# EAGLE schematic Power (EAGLE 8.5.2)
DESIGNER: Bradley L. Davis; PROJECT: CougSat-1; REV: 2.0.2

## Sheet 1 of 3
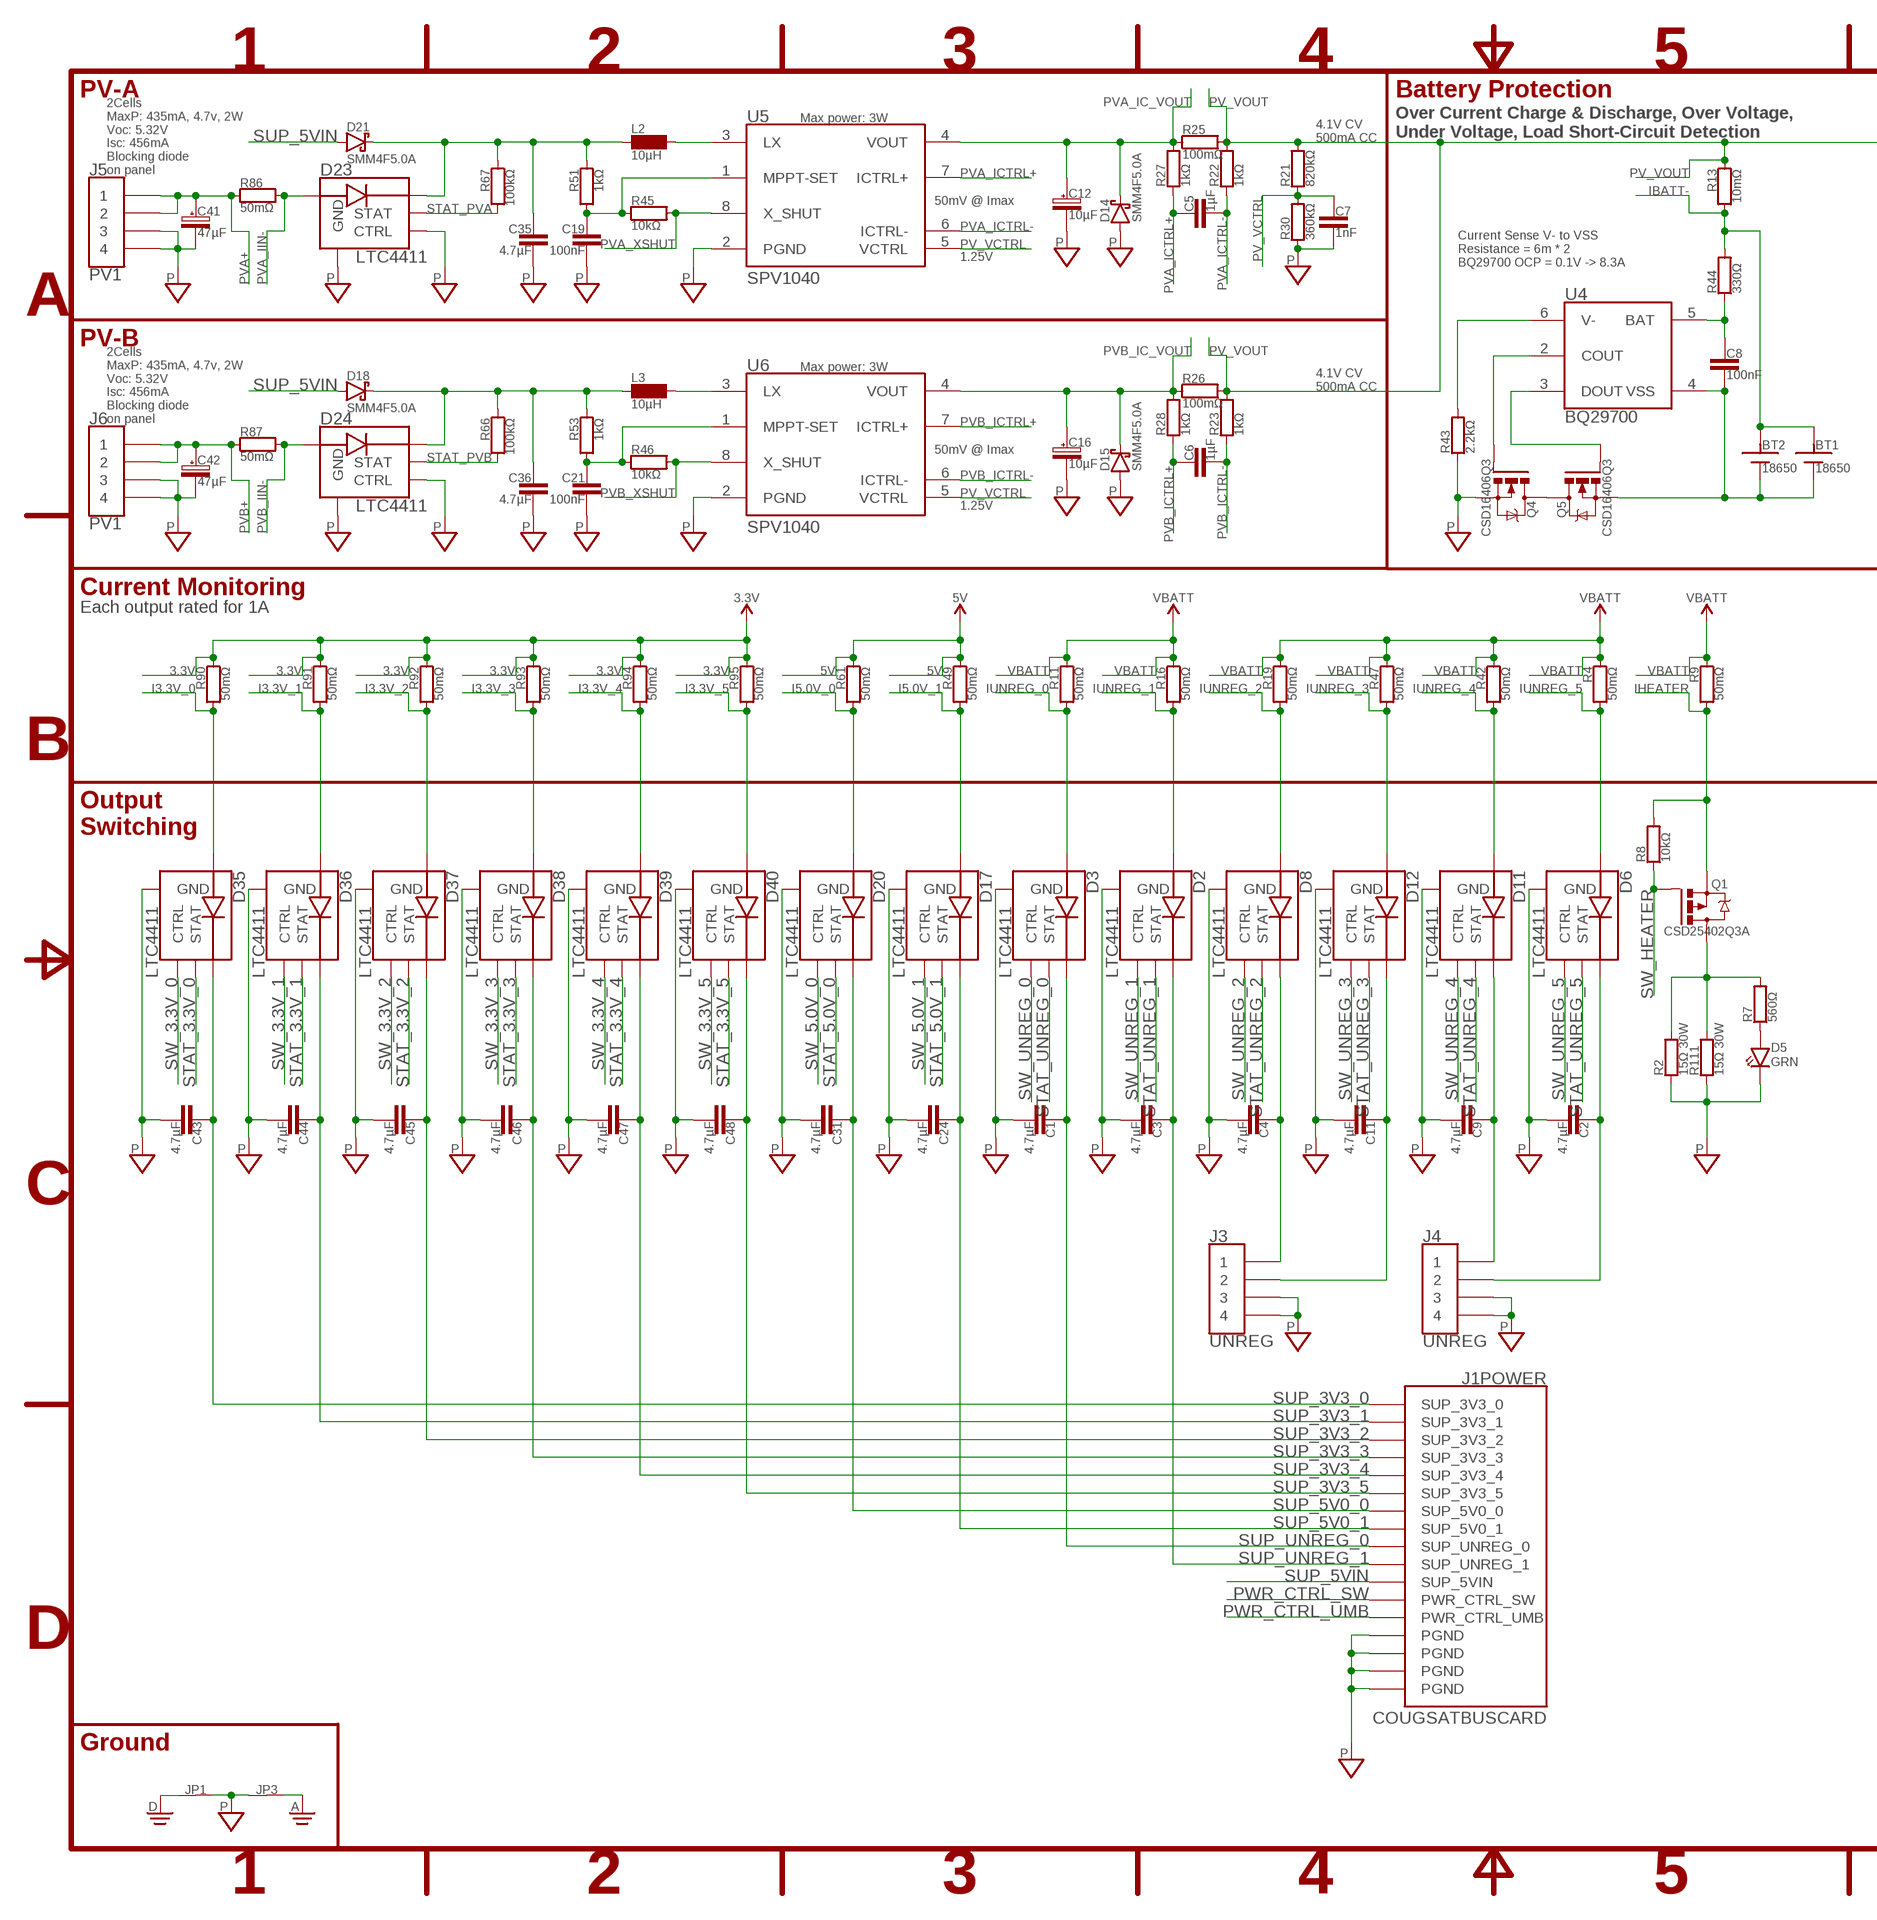
[diagram p0: schematic, sheet 1, part 1 of 2]
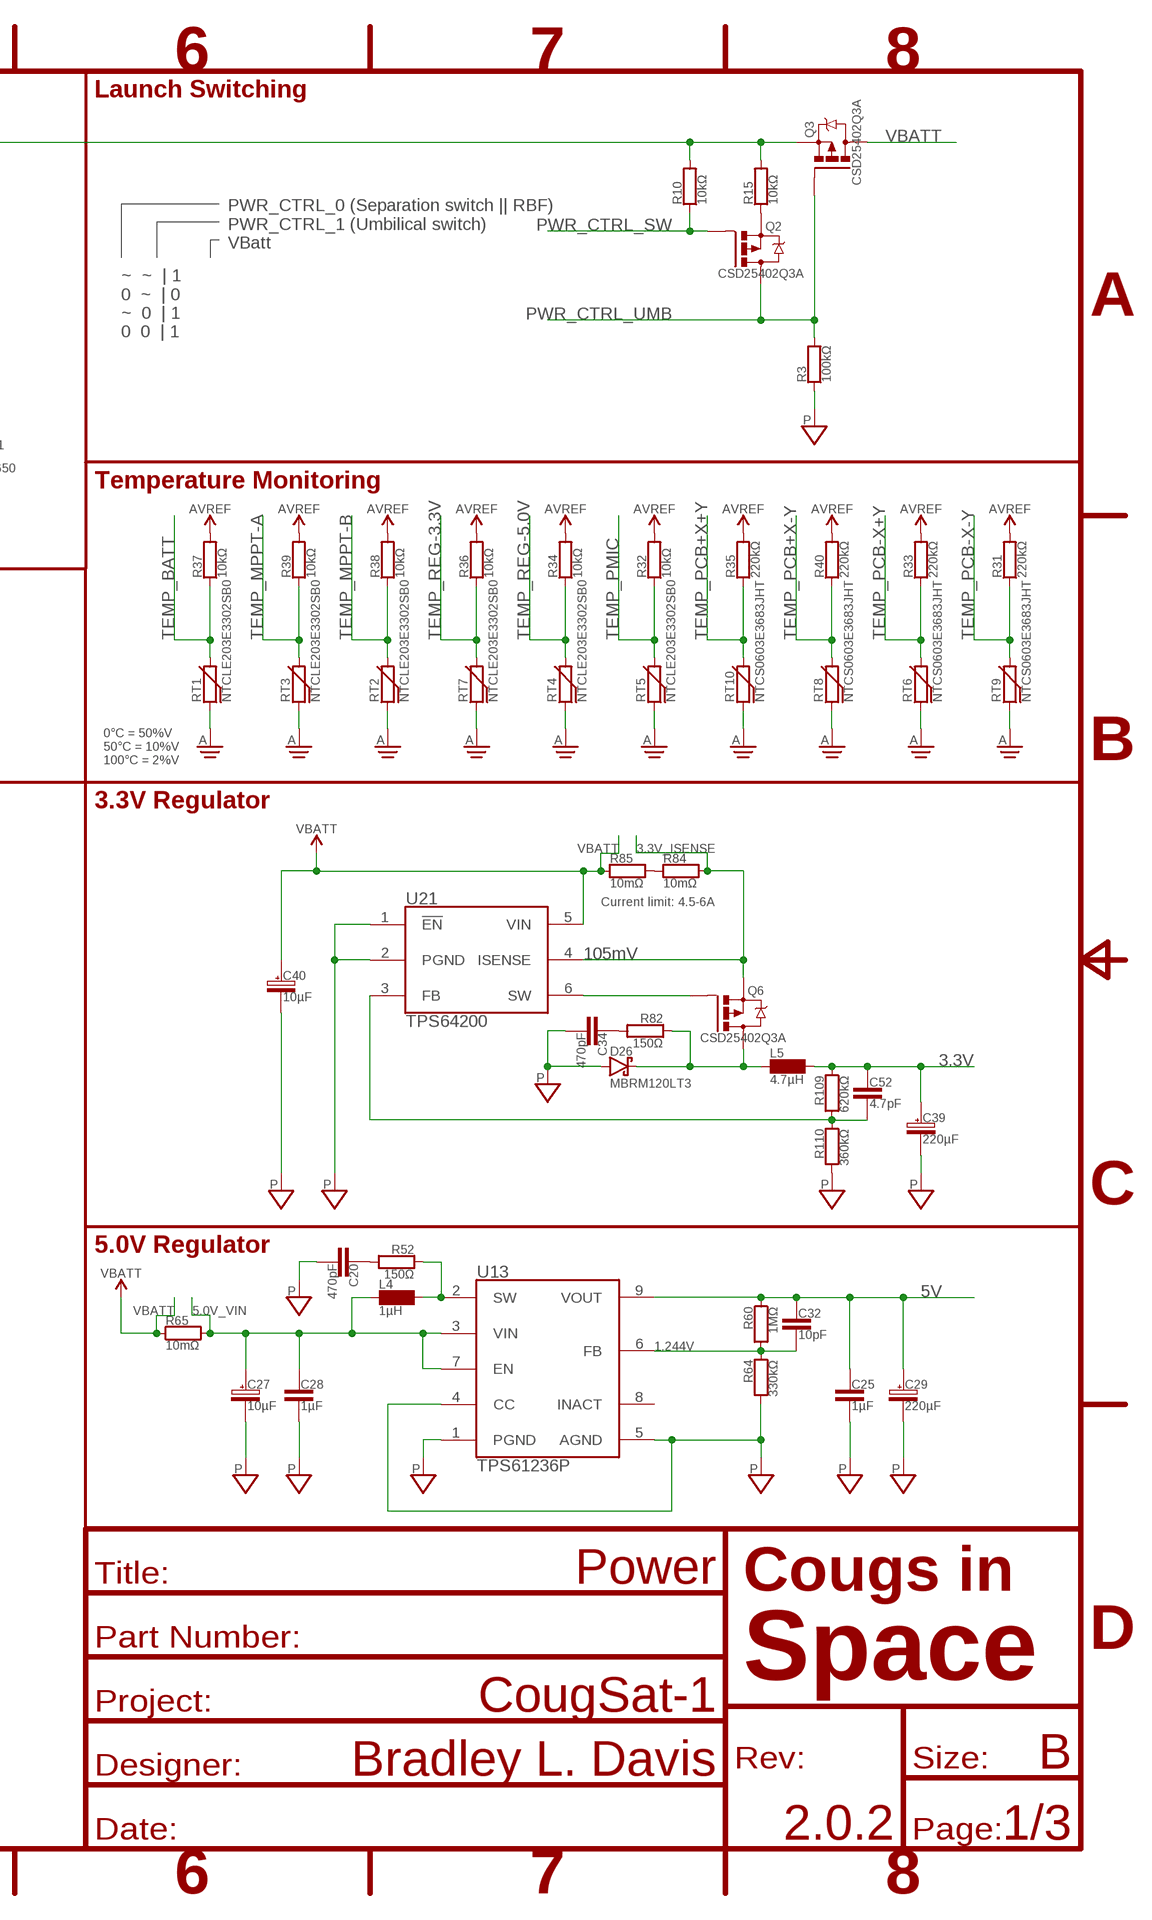
[diagram p1: schematic, sheet 1, part 2 of 2]

### Parts
BT1  18650  BATTERY18650SOLDER  [BAT-18650SOLDER]
BT2  18650  BATTERY18650SOLDER  [BAT-18650SOLDER]
C1  4.7µF  CAPACITOR3216  [3216]
C2  4.7µF  CAPACITOR3216  [3216]
C3  4.7µF  CAPACITOR3216  [3216]
C4  4.7µF  CAPACITOR3216  [3216]
C5  1µF  CAPACITOR1608  [1608]
C6  1µF  CAPACITOR1608  [1608]
C7  1nF  CAPACITOR1608  [1608]
C8  100nF  CAPACITOR1608  [1608]
C9  4.7µF  CAPACITOR3216  [3216]
C11  4.7µF  CAPACITOR3216  [3216]
C12  10µF  CAPACITOR-POLARIZED4028  [4028-POL]
C16  10µF  CAPACITOR-POLARIZED4028  [4028-POL]
C19  100nF  CAPACITOR1608  [1608]
C20  470pF  CAPACITOR1608  [1608]
C21  100nF  CAPACITOR1608  [1608]
C24  4.7µF  CAPACITOR3216  [3216]
C25  1µF  CAPACITOR1608  [1608]
C27  10µF  CAPACITOR-POLARIZED4028  [4028-POL]
C28  1µF  CAPACITOR1608  [1608]
C29  220µF  CAPACITOR-POLARIZED7132  [7132-POL]
C31  4.7µF  CAPACITOR3216  [3216]
C32  10pF  CAPACITOR1608  [1608]
C34  470pF  CAPACITOR1608  [1608]
C35  4.7µF  CAPACITOR3216  [3216]
C36  4.7µF  CAPACITOR3216  [3216]
C39  220µF  CAPACITOR-POLARIZED7132  [7132-POL]
C40  10µF  CAPACITOR-POLARIZED4028  [4028-POL]
C41  47µF  CAPACITOR-POLARIZED4028  [4028-POL]
C42  47µF  CAPACITOR-POLARIZED4028  [4028-POL]
C43  4.7µF  CAPACITOR3216  [3216]
C44  4.7µF  CAPACITOR3216  [3216]
C45  4.7µF  CAPACITOR3216  [3216]
C46  4.7µF  CAPACITOR3216  [3216]
C47  4.7µF  CAPACITOR3216  [3216]
C48  4.7µF  CAPACITOR3216  [3216]
C52  4.7pF  CAPACITOR1608  [1608]
D2  LTC4411  DIODE-IDEALSOT23-5  [SOT23-5]
D3  LTC4411  DIODE-IDEALSOT23-5  [SOT23-5]
D5  GRN  LED1608  [1608-POL]
D6  LTC4411  DIODE-IDEALSOT23-5  [SOT23-5]
D8  LTC4411  DIODE-IDEALSOT23-5  [SOT23-5]
D11  LTC4411  DIODE-IDEALSOT23-5  [SOT23-5]
D12  LTC4411  DIODE-IDEALSOT23-5  [SOT23-5]
D14  SMM4F5.0A  DIODE-SCHOTTKYSTMITE  [STMITE]
D15  SMM4F5.0A  DIODE-SCHOTTKYSTMITE  [STMITE]
D17  LTC4411  DIODE-IDEALSOT23-5  [SOT23-5]
D18  SMM4F5.0A  DIODE-SCHOTTKYSTMITE  [STMITE]
D20  LTC4411  DIODE-IDEALSOT23-5  [SOT23-5]
D21  SMM4F5.0A  DIODE-SCHOTTKYSTMITE  [STMITE]
D23  LTC4411  DIODE-IDEALSOT23-5  [SOT23-5]
D24  LTC4411  DIODE-IDEALSOT23-5  [SOT23-5]
D26  MBRM120LT3  DIODE-SCHOTTKYPOWERMITE1  [POWERMITE1]
D35  LTC4411  DIODE-IDEALSOT23-5  [SOT23-5]
D36  LTC4411  DIODE-IDEALSOT23-5  [SOT23-5]
D37  LTC4411  DIODE-IDEALSOT23-5  [SOT23-5]
D38  LTC4411  DIODE-IDEALSOT23-5  [SOT23-5]
D39  LTC4411  DIODE-IDEALSOT23-5  [SOT23-5]
D40  LTC4411  DIODE-IDEALSOT23-5  [SOT23-5]
J1  COUGSATBUSCARD  [COUGSATBUS_MALE-SODIMM]
J3  UNREG  CONN_04PICOLOCK1.5MM  [1X04_PICOLOCK1.5MM]
J4  UNREG  CONN_04PICOLOCK1.5MM  [1X04_PICOLOCK1.5MM]
J5  PV1  CONN_04PICOLOCK1.5MM  [1X04_PICOLOCK1.5MM]
J6  PV1  CONN_04PICOLOCK1.5MM  [1X04_PICOLOCK1.5MM]
JP1  SHORTCIRCUIT1608JUMPER  [1608]
JP3  SHORTCIRCUIT1608JUMPER  [1608]
L2  10µH  INDUCTORLPS6235  [INDUCTOR-LPS6235]
L3  10µH  INDUCTORLPS6235  [INDUCTOR-LPS6235]
L4  1µH  INDUCTORXAL7030  [INDUCTOR-XAL7030]
L5  4.7µH  INDUCTORXAL7030  [INDUCTOR-XAL7030]
Q1  CSD25402Q3A  MOSEFT-PCHANNELSON-3.3X3.3MM  [SON-3.3X3.3MM]
Q2  CSD25402Q3A  MOSEFT-PCHANNELSON-3.3X3.3MM  [SON-3.3X3.3MM]
Q3  CSD25402Q3A  MOSEFT-PCHANNELSON-3.3X3.3MM  [SON-3.3X3.3MM]
Q4  CSD16406Q3  MOSFET-NCHANNELSON-3.3X3.3MM  [SON-3.3X3.3MM]
Q5  CSD16406Q3  MOSFET-NCHANNELSON-3.3X3.3MM  [SON-3.3X3.3MM]
Q6  CSD25402Q3A  MOSEFT-PCHANNELSON-3.3X3.3MM  [SON-3.3X3.3MM]
R2  15Ω 30W  RESISTORTO220  [TO220-2]
R3  100kΩ  RESISTOR1608  [1608]
R4  50mΩ  RESISTOR1608  [1608]
R7  560Ω  RESISTOR1608  [1608]
R8  10kΩ  RESISTOR1608  [1608]
R9  50mΩ  RESISTOR1608  [1608]
R10  10kΩ  RESISTOR1608  [1608]
R11  50mΩ  RESISTOR1608  [1608]
R13  10mΩ  RESISTOR3216  [3216]
R15  10kΩ  RESISTOR1608  [1608]
R16  50mΩ  RESISTOR1608  [1608]
R19  50mΩ  RESISTOR1608  [1608]
R21  820kΩ  RESISTOR1608  [1608]
R22  1kΩ  RESISTOR1608  [1608]
R23  1kΩ  RESISTOR1608  [1608]
R25  100mΩ  RESISTOR1608  [1608]
R26  100mΩ  RESISTOR1608  [1608]
R27  1kΩ  RESISTOR1608  [1608]
R28  1kΩ  RESISTOR1608  [1608]
R30  360kΩ  RESISTOR1608  [1608]
R31  220kΩ  RESISTOR1608  [1608]
R32  10kΩ  RESISTOR1608  [1608]
R33  220kΩ  RESISTOR1608  [1608]
R34  10kΩ  RESISTOR1608  [1608]
R35  220kΩ  RESISTOR1608  [1608]
R36  10kΩ  RESISTOR1608  [1608]
R37  10kΩ  RESISTOR1608  [1608]
R38  10kΩ  RESISTOR1608  [1608]
R39  10kΩ  RESISTOR1608  [1608]
R40  220kΩ  RESISTOR1608  [1608]
R42  50mΩ  RESISTOR1608  [1608]
R43  2.2kΩ  RESISTOR1608  [1608]
R44  330Ω  RESISTOR1608  [1608]
R45  10kΩ  RESISTOR1608  [1608]
R46  10kΩ  RESISTOR1608  [1608]
R47  50mΩ  RESISTOR1608  [1608]
R49  50mΩ  RESISTOR1608  [1608]
R51  1kΩ  RESISTOR1608  [1608]
R52  150Ω  RESISTOR1608  [1608]
R53  1kΩ  RESISTOR1608  [1608]
R60  1MΩ  RESISTOR1608  [1608]
R61  50mΩ  RESISTOR1608  [1608]
R64  330kΩ  RESISTOR1608  [1608]
R65  10mΩ  RESISTOR3216  [3216]
R66  100kΩ  RESISTOR1608  [1608]
R67  100kΩ  RESISTOR1608  [1608]
R82  150Ω  RESISTOR1608  [1608]
R84  10mΩ  RESISTOR3216  [3216]
R85  10mΩ  RESISTOR3216  [3216]
R86  50mΩ  RESISTOR1608  [1608]
R87  50mΩ  RESISTOR1608  [1608]
R90  50mΩ  RESISTOR1608  [1608]
R91  50mΩ  RESISTOR1608  [1608]
R92  50mΩ  RESISTOR1608  [1608]
R93  50mΩ  RESISTOR1608  [1608]
R94  50mΩ  RESISTOR1608  [1608]
R95  50mΩ  RESISTOR1608  [1608]
R109  620kΩ  RESISTOR1608  [1608]
R110  360kΩ  RESISTOR1608  [1608]
R111  15Ω 30W  RESISTORTO220  [TO220-2]
RT1  NTCLE203E3302SB0  THERMISTORTHR-VERT  [1X02_THERMISTOR]
RT2  NTCLE203E3302SB0  THERMISTORTHR-VERT  [1X02_THERMISTOR]
RT3  NTCLE203E3302SB0  THERMISTORTHR-VERT  [1X02_THERMISTOR]
RT4  NTCLE203E3302SB0  THERMISTORTHR-VERT  [1X02_THERMISTOR]
RT5  NTCLE203E3302SB0  THERMISTORTHR-VERT  [1X02_THERMISTOR]
RT6  NTCS0603E3683JHT  THERMISTOR1608  [1608]
RT7  NTCLE203E3302SB0  THERMISTORTHR-VERT  [1X02_THERMISTOR]
RT8  NTCS0603E3683JHT  THERMISTOR1608  [1608]
RT9  NTCS0603E3683JHT  THERMISTOR1608  [1608]
RT10  NTCS0603E3683JHT  THERMISTOR1608  [1608]
U4  BQ29700  BQ2970  [SON6-1.5X1.5MM]
U5  SPV1040  [TSSOP8]
U6  SPV1040  [TSSOP8]
U13  TPS61236P  [QFN-TPS61236P]
U21  TPS64200  [SOT23-6]

### Nets
3.3V: C39.A C52.1 L5.2 R90.1 R91.1 R92.1 R93.1 R94.1 R95.1 R109.1 ; also sheet 2
3.3V_FB: C52.2 R109.2 R110.1 U21.3(FB)
3.3V_ISENSE: Q6.5(S) Q6.6(S) Q6.7(S) Q6.8(S) Q6.PAD(S) R84.2 U21.4(ISENSE) ; also sheet 2
3.3V_LSW: D26.C L5.11 Q6.1(D) Q6.2(D) Q6.3(D) R82.1
3.3V_RISENSE: R84.1 R85.2
3.3V_SNUBBER: C34.1 R82.2
3.3V_SW: Q6.4(G) U21.6(SW)
5.0V_FB: C32.2 R60.2 R64.1 U13.6(FB)
5.0V_SNUBBER: C20.1 R52.2
5.0V_SW: L4.2 R52.1 U13.2(SW)
5.0V_VIN: C27.A C28.1 L4.11 R65.2 U13.3(VIN) U13.7(EN) ; also sheet 2
5V: C25.1 C29.A C32.1 R49.1 R60.1 R61.1 U13.9(VOUT) ; also sheet 2
AGND: JP3.2 RT1.1 RT2.1 RT3.1 RT4.1 RT5.1 RT6.1 RT7.1 RT8.1 RT9.1 RT10.1 ; also sheet 2
AVREF: R31.2 R32.2 R33.2 R34.2 R35.2 R36.2 R37.2 R38.2 R39.2 R40.2 ; also sheet 2
BATTPROTECT_BAT: C8.1 R44.1 U4.5(BAT)
BATTPROTECT_COUT: Q4.4(G) U4.2(COUT)
BATTPROTECT_SW: Q4.5(D) Q4.6(D) Q4.7(D) Q4.8(D) Q4.PAD(D) Q5.5(D) Q5.6(D) Q5.7(D) Q5.8(D) Q5.PAD(D)
BATTPROTECT_V-: R43.2 U4.6(V-)
BATTPROTECT_VSS: BT1.A BT2.A C8.2 Q5.1(S) Q5.2(S) Q5.3(S) U4.4(VSS)
BATTPROTECTDOUT: Q5.4(G) U4.3(DOUT)
DGND: JP1.1 ; also sheet 2
I3.3V_0: D35.1(IN) R90.2 ; also sheet 2
I3.3V_1: D36.1(IN) R91.2 ; also sheet 2
I3.3V_2: D37.1(IN) R92.2 ; also sheet 2
I3.3V_3: D38.1(IN) R93.2 ; also sheet 2
I3.3V_4: D39.1(IN) R94.2 ; also sheet 2
I3.3V_5: D40.1(IN) R95.2 ; also sheet 2
I5.0V_0: D20.1(IN) R61.2 ; also sheet 2
I5.0V_1: D17.1(IN) R49.2 ; also sheet 2
IBATT-: BT1.C BT2.C R13.2 R44.2 ; also sheet 2
IHEATER: Q1.5(S) Q1.6(S) Q1.7(S) Q1.8(S) Q1.PAD(S) R8.2 R9.2 ; also sheet 2
IUNREG_0: D3.1(IN) R11.2 ; also sheet 2
IUNREG_1: D2.1(IN) R16.2 ; also sheet 2
IUNREG_2: D8.1(IN) R19.2 ; also sheet 2
IUNREG_3: D12.1(IN) R47.2 ; also sheet 2
IUNREG_4: D11.1(IN) R42.2 ; also sheet 2
IUNREG_5: D6.1(IN) R4.2 ; also sheet 2
MPPTA_VIN: C35.1 D21.A(C) D23.5(OUT) L2.2 R51.1 R67.1
MPPTB_VIN: C36.1 D18.A(C) D24.5(OUT) L3.2 R53.1 R66.1
PGND: C1.2 C2.2 C3.2 C4.2 C7.2 C9.2 C11.2 C12.C C16.C C19.2 C20.2 C21.2 C24.2 C25.2 C27.C C28.2 C29.C C31.2 C34.2 C35.2 C36.2 C39.C C40.C C41.C C42.C C43.2 C44.2 C45.2 C46.2 C47.2 C48.2 D2.2(GND) D3.2(GND) D5.C D6.2(GND) D8.2(GND) D11.2(GND) D12.2(GND) D14.C(A) D15.C(A) D17.2(GND) D20.2(GND) D23.2(GND) D23.3(CTRL) D24.2(GND) D24.3(CTRL) D26.A D35.2(GND) D36.2(GND) D37.2(GND) D38.2(GND) D39.2(GND) D40.2(GND) J1.1(POWER:PGND) J1.3(POWER:PGND) J1.5(POWER:PGND) J1.7(POWER:PGND) J1.9(POWER:PGND) J1.11(POWER:PGND) J1.13(POWER:PGND) J1.15(POWER:PGND) J1.17(POWER:PGND) J1.19(POWER:PGND) J1.41(POWER:PGND) J1.43(POWER:PGND) J1.45(POWER:PGND) J1.47(POWER:PGND) J1.49(POWER:PGND) J1.51(POWER:PGND) J1.53(POWER:PGND) J1.55(POWER:PGND) J1.57(POWER:PGND) J1.59(POWER:PGND) J1.61(POWER:PGND) J1.63(POWER:PGND) J1.65(POWER:PGND) J1.67(POWER:PGND) J1.69(POWER:PGND) J1.82(POWER:PGND) J1.84(POWER:PGND) J1.86(POWER:PGND) J1.88(POWER:PGND) J1.90(POWER:PGND) J1.92(POWER:PGND) J1.94(POWER:PGND) J1.96(POWER:PGND) J1.98(POWER:PGND) J1.100(POWER:PGND) J1.102(POWER:PGND) J1.104(POWER:PGND) J1.106(POWER:PGND) J1.108(POWER:PGND) J1.110(POWER:PGND) J1.112(POWER:PGND) J1.114(POWER:PGND) J1.116(POWER:PGND) J1.118(POWER:PGND) J1.120(POWER:PGND) J1.122(POWER:PGND) J1.124(POWER:PGND) J1.126(POWER:PGND) J1.128(POWER:PGND) J1.130(POWER:PGND) J1.131(POWER:PGND) J1.132(POWER:PGND) J1.133(POWER:PGND) J1.134(POWER:PGND) J1.135(POWER:PGND) J1.136(POWER:PGND) J1.137(POWER:PGND) J1.138(POWER:PGND) J1.139(POWER:PGND) J1.140(POWER:PGND) J3.3 J3.4 J4.3 J4.4 J5.3 J5.4 J6.3 J6.4 JP1.2 JP3.1 Q4.1(S) Q4.2(S) Q4.3(S) R2.1 R3.1 R30.1 R43.1 R64.2 R110.2 R111.1 U5.2(PGND) U6.2(PGND) U13.1(PGND) U13.4(CC) U13.5(AGND) U21.1(!EN) U21.2(PGND) ; also sheet 2
PV_VCTRL: C7.1 R21.1 R30.2 U5.5(VCTRL) U6.5(VCTRL)
PV_VOUT: Q3.5(S) Q3.6(S) Q3.7(S) Q3.8(S) Q3.PAD(S) R10.2 R13.1 R15.2 R21.2 R22.2 R23.2 R25.2 R26.2 ; also sheet 2
PVA+: C41.A J5.1 J5.2 R86.1 ; also sheet 2
PVA_IC_VOUT: C12.A D14.A(C) R25.1 R27.2 U5.4(VOUT) ; also sheet 2
PVA_ICTRL+: C5.1 R27.1 U5.7(ICTRL+)
PVA_ICTRL-: C5.2 R22.1 U5.6(ICTRL-)
PVA_IIN-: D23.1(IN) R86.2 ; also sheet 2
PVA_LX: L2.1 U5.3(LX)
PVA_MPPTSET: C19.1 R45.1 R51.2 U5.1(MPPT-SET)
PVA_XSHUT: R45.2 U5.8(X_SHUT) ; also sheet 2
PVB+: C42.A J6.1 J6.2 R87.1 ; also sheet 2
PVB_IC_VOUT: C16.A D15.A(C) R26.1 R28.2 U6.4(VOUT) ; also sheet 2
PVB_ICTRL+: C6.1 R28.1 U6.7(ICTRL+)
PVB_ICTRL-: C6.2 R23.1 U6.6(ICTRL-)
PVB_IIN-: D24.1(IN) R87.2 ; also sheet 2
PVB_LX: L3.1 U6.3(LX)
PVB_MPPTSET: C21.1 R46.1 R53.2 U6.1(MPPT-SET)
PVB_XSHUT: R46.2 U6.8(X_SHUT) ; also sheet 2
PWR_CTRL_0_SW+: Q2.5(S) Q2.6(S) Q2.7(S) Q2.8(S) Q2.PAD(S) R15.1
PWR_CTRL_SW: J1.166(POWER:PWR_CTRL_SW) J1.168(POWER:PWR_CTRL_SW) Q2.4(G) R10.1
PWR_CTRL_UMB: J1.170(POWER:PWR_CTRL_UMB) J1.172(POWER:PWR_CTRL_UMB) Q2.1(D) Q2.2(D) Q2.3(D) Q3.4(G) R3.2
STAT_3.3V_0: D35.4(STAT) ; also sheet 2
STAT_3.3V_1: D36.4(STAT) ; also sheet 2
STAT_3.3V_2: D37.4(STAT) ; also sheet 2
STAT_3.3V_3: D38.4(STAT) ; also sheet 2
STAT_3.3V_4: D39.4(STAT) ; also sheet 2
STAT_3.3V_5: D40.4(STAT) ; also sheet 2
STAT_5.0V_0: D20.4(STAT) ; also sheet 2
STAT_5.0V_1: D17.4(STAT) ; also sheet 2
STAT_HEATER: D5.A R7.1
STAT_PVA: D23.4(STAT) R67.2 ; also sheet 2
STAT_PVB: D24.4(STAT) R66.2 ; also sheet 2
STAT_UNREG_0: D3.4(STAT) ; also sheet 2
STAT_UNREG_1: D2.4(STAT) ; also sheet 2
STAT_UNREG_2: D8.4(STAT) ; also sheet 2
STAT_UNREG_3: D12.4(STAT) ; also sheet 2
STAT_UNREG_4: D11.4(STAT) ; also sheet 2
STAT_UNREG_5: D6.4(STAT) ; also sheet 2
SUP_3V3_0: C43.1 D35.5(OUT) J1.2(POWER:SUP_3V3_0) J1.4(POWER:SUP_3V3_0) J1.6(POWER:SUP_3V3_0) J1.8(POWER:SUP_3V3_0) J1.10(POWER:SUP_3V3_0)
SUP_3V3_1: C44.1 D36.5(OUT) J1.12(POWER:SUP_3V3_1) J1.14(POWER:SUP_3V3_1) J1.16(POWER:SUP_3V3_1) J1.18(POWER:SUP_3V3_1) J1.20(POWER:SUP_3V3_1)
SUP_3V3_2: C45.1 D37.5(OUT) J1.21(POWER:SUP_3V3_2) J1.23(POWER:SUP_3V3_2) J1.25(POWER:SUP_3V3_2) J1.27(POWER:SUP_3V3_2) J1.29(POWER:SUP_3V3_2) J1.31(POWER:SUP_3V3_2) J1.33(POWER:SUP_3V3_2) J1.35(POWER:SUP_3V3_2) J1.37(POWER:SUP_3V3_2) J1.39(POWER:SUP_3V3_2)
SUP_3V3_3: C46.1 D38.5(OUT) J1.22(POWER:SUP_3V3_3) J1.24(POWER:SUP_3V3_3) J1.26(POWER:SUP_3V3_3) J1.28(POWER:SUP_3V3_3) J1.30(POWER:SUP_3V3_3) J1.32(POWER:SUP_3V3_3) J1.34(POWER:SUP_3V3_3) J1.36(POWER:SUP_3V3_3) J1.38(POWER:SUP_3V3_3) J1.40(POWER:SUP_3V3_3)
SUP_3V3_4: C47.1 D39.5(OUT) J1.42(POWER:SUP_3V3_4) J1.44(POWER:SUP_3V3_4) J1.46(POWER:SUP_3V3_4) J1.48(POWER:SUP_3V3_4) J1.50(POWER:SUP_3V3_4)
SUP_3V3_5: C48.1 D40.5(OUT) J1.52(POWER:SUP_3V3_5) J1.54(POWER:SUP_3V3_5) J1.56(POWER:SUP_3V3_5) J1.58(POWER:SUP_3V3_5) J1.60(POWER:SUP_3V3_5)
SUP_5V0_0: C31.1 D20.5(OUT) J1.62(POWER:SUP_5V0_0) J1.64(POWER:SUP_5V0_0) J1.66(POWER:SUP_5V0_0) J1.68(POWER:SUP_5V0_0) J1.70(POWER:SUP_5V0_0) J1.72(POWER:SUP_5V0_0) J1.74(POWER:SUP_5V0_0) J1.76(POWER:SUP_5V0_0) J1.78(POWER:SUP_5V0_0) J1.80(POWER:SUP_5V0_0)
SUP_5V0_1: C24.1 D17.5(OUT) J1.71(POWER:SUP_5V0_1) J1.73(POWER:SUP_5V0_1) J1.75(POWER:SUP_5V0_1) J1.77(POWER:SUP_5V0_1) J1.79(POWER:SUP_5V0_1) J1.81(POWER:SUP_5V0_1) J1.83(POWER:SUP_5V0_1) J1.85(POWER:SUP_5V0_1) J1.87(POWER:SUP_5V0_1) J1.89(POWER:SUP_5V0_1)
SUP_5VIN: D18.C(A) D21.C(A) J1.182(POWER:SUP_5VIN) J1.184(POWER:SUP_5VIN) J1.186(POWER:SUP_5VIN) J1.188(POWER:SUP_5VIN) J1.190(POWER:SUP_5VIN) J1.192(POWER:SUP_5VIN) J1.194(POWER:SUP_5VIN) J1.196(POWER:SUP_5VIN) J1.198(POWER:SUP_5VIN) J1.200(POWER:SUP_5VIN)
SUP_HEATER: Q1.1(D) Q1.2(D) Q1.3(D) R2.3 R7.2 R111.3
SUP_UNREG_0: C1.1 D3.5(OUT) J1.91(POWER:SUP_UNREG_0) J1.93(POWER:SUP_UNREG_0) J1.95(POWER:SUP_UNREG_0) J1.97(POWER:SUP_UNREG_0) J1.99(POWER:SUP_UNREG_0) J1.101(POWER:SUP_UNREG_0) J1.103(POWER:SUP_UNREG_0) J1.105(POWER:SUP_UNREG_0) J1.107(POWER:SUP_UNREG_0) J1.109(POWER:SUP_UNREG_0)
SUP_UNREG_1: C3.1 D2.5(OUT) J1.111(POWER:SUP_UNREG_1) J1.113(POWER:SUP_UNREG_1) J1.115(POWER:SUP_UNREG_1) J1.117(POWER:SUP_UNREG_1) J1.119(POWER:SUP_UNREG_1) J1.121(POWER:SUP_UNREG_1) J1.123(POWER:SUP_UNREG_1) J1.125(POWER:SUP_UNREG_1) J1.127(POWER:SUP_UNREG_1) J1.129(POWER:SUP_UNREG_1)
SUP_UNREG_2: C4.1 D8.5(OUT) J3.1
SUP_UNREG_3: C11.1 D12.5(OUT) J3.2
SUP_UNREG_4: C9.1 D11.5(OUT) J4.1
SUP_UNREG_5: C2.1 D6.5(OUT) J4.2
SW_3.3V_0: D35.3(CTRL) ; also sheet 2
SW_3.3V_1: D36.3(CTRL) ; also sheet 2
SW_3.3V_2: D37.3(CTRL) ; also sheet 2
SW_3.3V_3: D38.3(CTRL) ; also sheet 2
SW_3.3V_4: D39.3(CTRL) ; also sheet 2
SW_3.3V_5: D40.3(CTRL) ; also sheet 2
SW_5.0V_0: D20.3(CTRL) ; also sheet 2
SW_5.0V_1: D17.3(CTRL) ; also sheet 2
SW_HEATER: Q1.4(G) R8.1 ; also sheet 2
SW_UNREG_0: D3.3(CTRL) ; also sheet 2
SW_UNREG_1: D2.3(CTRL) ; also sheet 2
SW_UNREG_2: D8.3(CTRL) ; also sheet 2
SW_UNREG_3: D12.3(CTRL) ; also sheet 2
SW_UNREG_4: D11.3(CTRL) ; also sheet 2
SW_UNREG_5: D6.3(CTRL) ; also sheet 2
TEMP_BATT: R37.1 RT1.2 ; also sheet 2
TEMP_MPPT-A: R39.1 RT3.2 ; also sheet 2
TEMP_MPPT-B: R38.1 RT2.2 ; also sheet 2
TEMP_PCB+X+Y: R35.1 RT10.2 ; also sheet 2
TEMP_PCB+X-Y: R40.1 RT8.2 ; also sheet 2
TEMP_PCB-X+Y: R33.1 RT6.2 ; also sheet 2
TEMP_PCB-X-Y: R31.1 RT9.2 ; also sheet 2
TEMP_PMIC: R32.1 RT5.2 ; also sheet 2
TEMP_REG-3.3V: R36.1 RT7.2 ; also sheet 2
TEMP_REG-5.0V: R34.1 RT4.2 ; also sheet 2
VBATT: C40.A Q3.1(D) Q3.2(D) Q3.3(D) R4.1 R9.1 R11.1 R16.1 R19.1 R42.1 R47.1 R65.1 R85.1 U21.5(VIN) ; also sheet 2
Unconnected: U13.8(INACT)

### Notes on the sheet
- PV-A | Battery Protection | Launch Switching
- Over Current Charge & Discharge, Over Voltage,
  Under Voltage, Load Short-Circuit Detection
- Max power: 3W
- 4.1V CV
  500mA CC
- 2Cells
  MaxP: 435mA, 4.7v, 2W
  Voc: 5.32V 
  Isc: 456mA
  Blocking diode
  on panel
- 50mV @ Imax
- PWR_CTRL_0 (Separation switch || RBF)
  PWR_CTRL_1 (Umbilical switch)
  VBatt
- 1.25V
- Current Sense V- to VSS
  Resistance = 6m * 2
  BQ29700 OCP = 0.1V -> 8.3A
- PV-B
- ~  ~  | 1
  0  ~  | 0
  ~  0  | 1
  0  0  | 1
- Max power: 3W
- 4.1V CV
  500mA CC
- 2Cells
  MaxP: 435mA, 4.7v, 2W
  Voc: 5.32V 
  Isc: 456mA
  Blocking diode
  on panel
- 50mV @ Imax
- Temperature Monitoring
- 1.25V
- Current Monitoring
- Each output rated for 1A
- 0°C = 50%V
  50°C = 10%V
  100°C = 2%V
- Output
  Switching
- 3.3V Regulator
- Current limit: 4.5-6A
- 105mV
- 5.0V Regulator
- 1.244V
- Ground

## Sheet 2 of 3
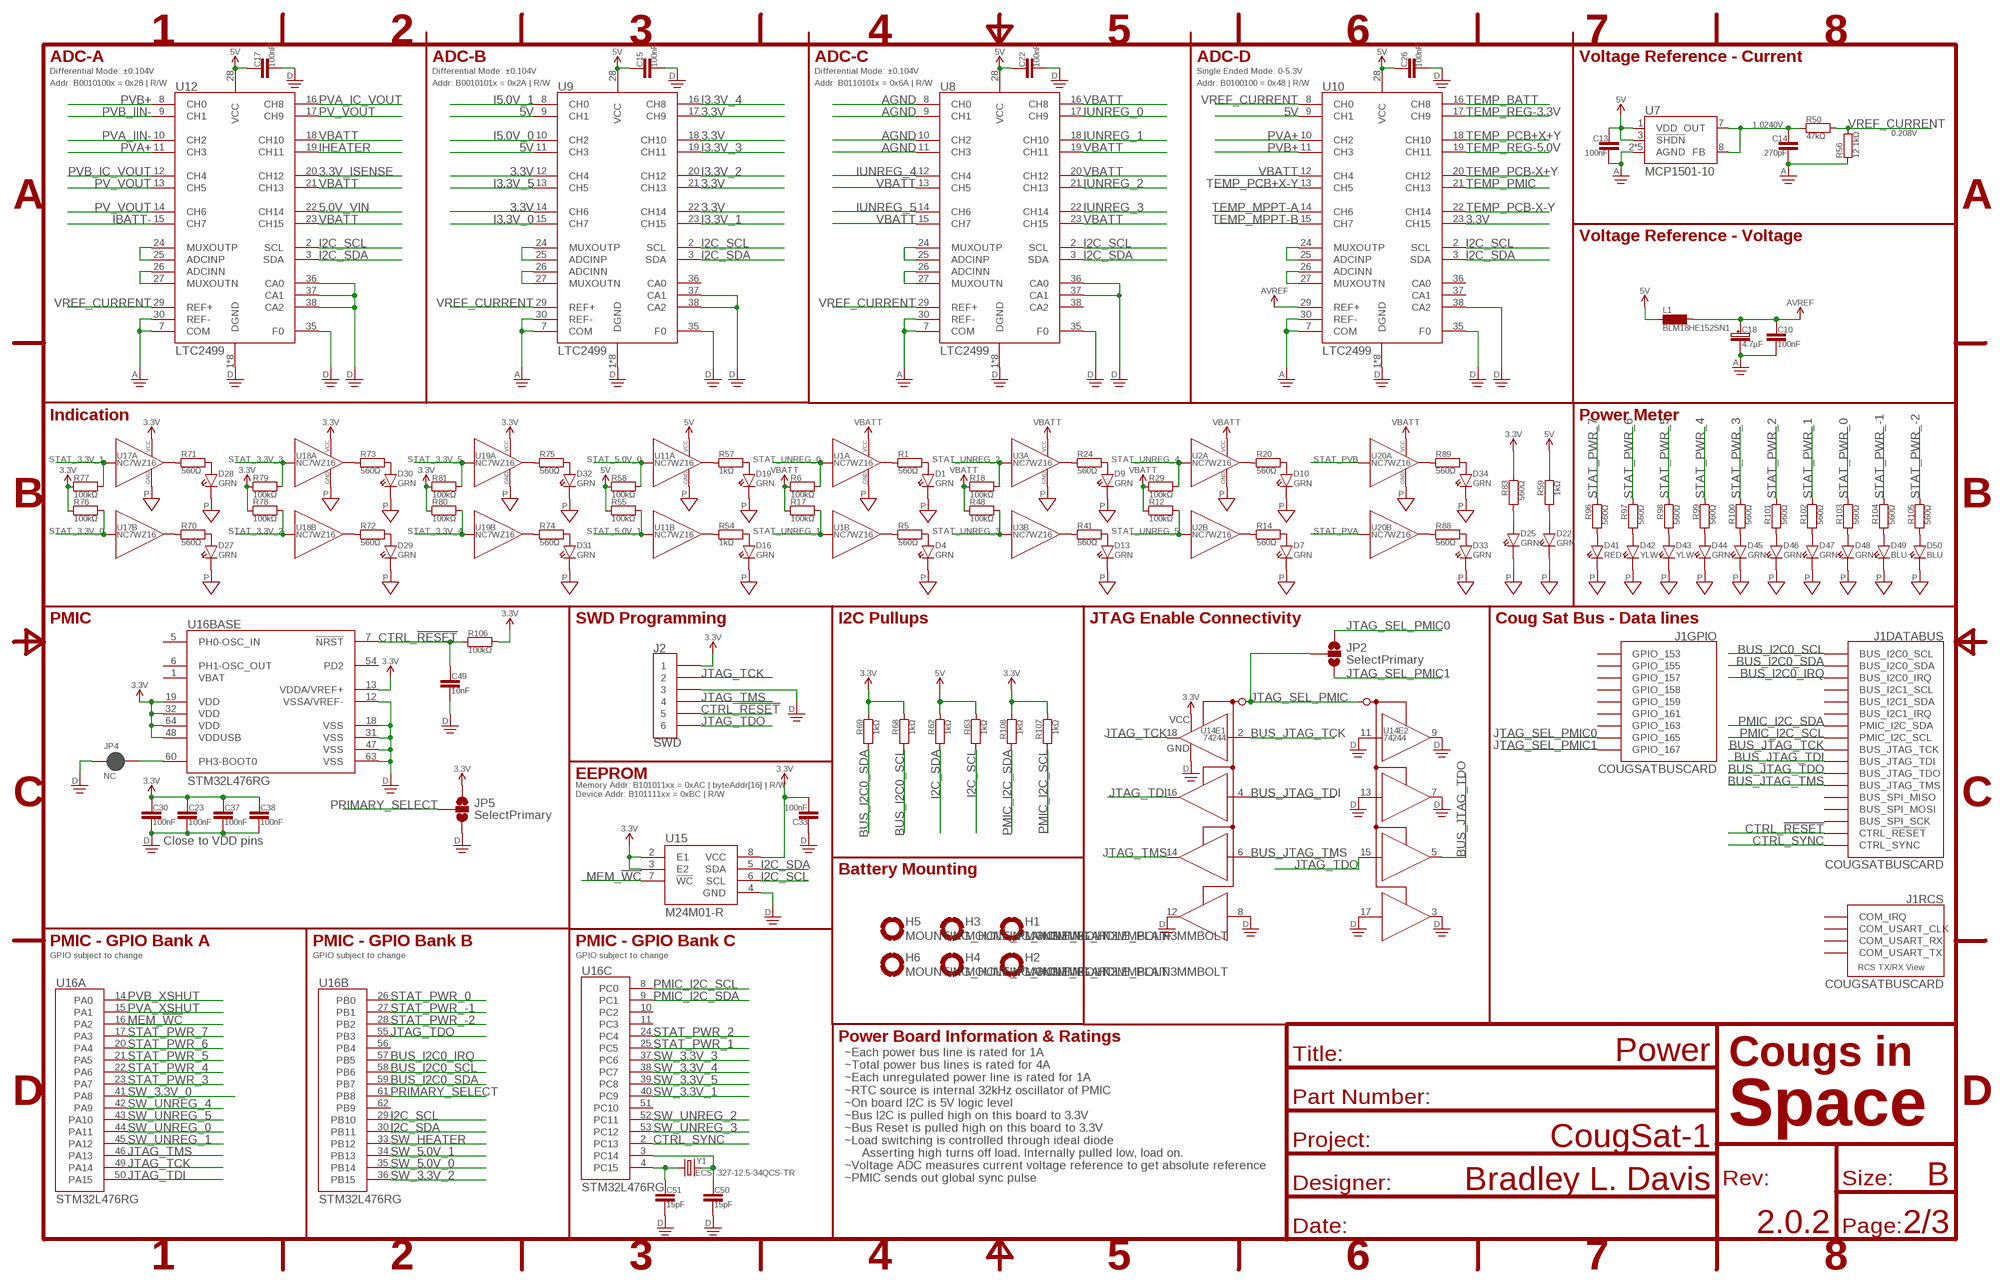
[diagram p2: schematic, sheet 2]

### Parts
C10  100nF  CAPACITOR1608  [1608]
C13  100nF  CAPACITOR1608  [1608]
C14  270pF  CAPACITOR1608  [1608]
C15  100nF  CAPACITOR1608  [1608]
C17  100nF  CAPACITOR1608  [1608]
C18  4.7µF  CAPACITOR-POLARIZED4028  [4028-POL]
C22  100nF  CAPACITOR1608  [1608]
C23  100nF  CAPACITOR1608  [1608]
C26  100nF  CAPACITOR3216  [3216]
C30  100nF  CAPACITOR1608  [1608]
C33  100nF  CAPACITOR1608  [1608]
C37  100nF  CAPACITOR1608  [1608]
C38  100nF  CAPACITOR1608  [1608]
C49  10nF  CAPACITOR1608  [1608]
C50  15pF  CAPACITOR1608  [1608]
C51  15pF  CAPACITOR1608  [1608]
D1  GRN  LED1608  [1608-POL]
D4  GRN  LED1608  [1608-POL]
D7  GRN  LED1608  [1608-POL]
D9  GRN  LED1608  [1608-POL]
D10  GRN  LED1608  [1608-POL]
D13  GRN  LED1608  [1608-POL]
D16  GRN  LED1608  [1608-POL]
D19  GRN  LED1608  [1608-POL]
D22  GRN  LED1608  [1608-POL]
D25  GRN  LED1608  [1608-POL]
D27  GRN  LED1608  [1608-POL]
D28  GRN  LED1608  [1608-POL]
D29  GRN  LED1608  [1608-POL]
D30  GRN  LED1608  [1608-POL]
D31  GRN  LED1608  [1608-POL]
D32  GRN  LED1608  [1608-POL]
D33  GRN  LED1608  [1608-POL]
D34  GRN  LED1608  [1608-POL]
D41  RED  LED1608  [1608-POL]
D42  YLW  LED1608  [1608-POL]
D43  YLW  LED1608  [1608-POL]
D44  GRN  LED1608  [1608-POL]
D45  GRN  LED1608  [1608-POL]
D46  GRN  LED1608  [1608-POL]
D47  GRN  LED1608  [1608-POL]
D48  GRN  LED1608  [1608-POL]
D49  BLU  LED1608  [1608-POL]
D50  BLU  LED1608  [1608-POL]
H1  MOUNTING_HOLE_PLAIN3MMBOLT  [HOLE-3.3MM_PLAIN]
H2  MOUNTING_HOLE_PLAIN3MMBOLT  [HOLE-3.3MM_PLAIN]
H3  MOUNTING_HOLE_PLAIN3MMBOLT  [HOLE-3.3MM_PLAIN]
H4  MOUNTING_HOLE_PLAIN3MMBOLT  [HOLE-3.3MM_PLAIN]
H5  MOUNTING_HOLE_PLAIN3MMBOLT  [HOLE-3.3MM_PLAIN]
H6  MOUNTING_HOLE_PLAIN3MMBOLT  [HOLE-3.3MM_PLAIN]
J2  SWD  CONN_061X06_SMD-2.54MM-R  [1X06_SMD-2.54MM-R]
JP2  SelectPrimary  JUMPER-SMT_3_NO_SILK  [SMT-JUMPER_3_NO_SILK]
JP4  NC  JUMPER-SMT_2_NC_PASTE_SILK  [SMT-JUMPER_2_NC_PASTE_SILK]
JP5  SelectPrimary  JUMPER-SMT_3_NO_SILK  [SMT-JUMPER_3_NO_SILK]
L1  BLM18HE152SN1  INDUCTOR1608  [1608]
R1  560Ω  RESISTOR1608  [1608]
R5  560Ω  RESISTOR1608  [1608]
R6  100kΩ  RESISTOR1608  [1608]
R12  100kΩ  RESISTOR1608  [1608]
R14  560Ω  RESISTOR1608  [1608]
R17  100kΩ  RESISTOR1608  [1608]
R18  100kΩ  RESISTOR1608  [1608]
R20  560Ω  RESISTOR1608  [1608]
R24  560Ω  RESISTOR1608  [1608]
R29  100kΩ  RESISTOR1608  [1608]
R41  560Ω  RESISTOR1608  [1608]
R48  100kΩ  RESISTOR1608  [1608]
R50  47kΩ  RESISTOR1608  [1608]
R54  1kΩ  RESISTOR1608  [1608]
R55  100kΩ  RESISTOR1608  [1608]
R56  12.1kΩ  RESISTOR1608  [1608]
R57  1kΩ  RESISTOR1608  [1608]
R58  100kΩ  RESISTOR1608  [1608]
R59  1kΩ  RESISTOR1608  [1608]
R62  1kΩ  RESISTOR1608  [1608]
R63  1kΩ  RESISTOR1608  [1608]
R68  1kΩ  RESISTOR1608  [1608]
R69  1kΩ  RESISTOR1608  [1608]
R70  560Ω  RESISTOR1608  [1608]
R71  560Ω  RESISTOR1608  [1608]
R72  560Ω  RESISTOR1608  [1608]
R73  560Ω  RESISTOR1608  [1608]
R74  560Ω  RESISTOR1608  [1608]
R75  560Ω  RESISTOR1608  [1608]
R76  100kΩ  RESISTOR1608  [1608]
R77  100kΩ  RESISTOR1608  [1608]
R78  100kΩ  RESISTOR1608  [1608]
R79  100kΩ  RESISTOR1608  [1608]
R80  100kΩ  RESISTOR1608  [1608]
R81  100kΩ  RESISTOR1608  [1608]
R83  560Ω  RESISTOR1608  [1608]
R88  560Ω  RESISTOR1608  [1608]
R89  560Ω  RESISTOR1608  [1608]
R96  560Ω  RESISTOR1608  [1608]
R97  560Ω  RESISTOR1608  [1608]
R98  560Ω  RESISTOR1608  [1608]
R99  560Ω  RESISTOR1608  [1608]
R100  560Ω  RESISTOR1608  [1608]
R101  560Ω  RESISTOR1608  [1608]
R102  560Ω  RESISTOR1608  [1608]
R103  560Ω  RESISTOR1608  [1608]
R104  560Ω  RESISTOR1608  [1608]
R105  560Ω  RESISTOR1608  [1608]
R106  100kΩ  RESISTOR1608  [1608]
R107  1kΩ  RESISTOR1608  [1608]
R108  1kΩ  RESISTOR1608  [1608]
U1  NC7WZ16  BUFFER-2X1BITSC70  [SC70]
U2  NC7WZ16  BUFFER-2X1BITSC70  [SC70]
U3  NC7WZ16  BUFFER-2X1BITSC70  [SC70]
U7  MCP1501-10  VOLTAGEREFERENCEWDFN8  [WDFN8-2X2]
U8  LTC2499  [QFN38-5X7]
U9  LTC2499  [QFN38-5X7]
U10  LTC2499  [QFN38-5X7]
U11  NC7WZ16  BUFFER-2X1BITSC70  [SC70]
U12  LTC2499  [QFN38-5X7]
U14  74244  BUFFER_TRISTATE-2X4BIT  [QFN20-3.5X4.5]
U15  M24M01-R  EEPROMSO8  [SO8]
U16  STM32L476RG  STM32L476RT  [QFP64-10X10]
U17  NC7WZ16  BUFFER-2X1BITSC70  [SC70]
U18  NC7WZ16  BUFFER-2X1BITSC70  [SC70]
U19  NC7WZ16  BUFFER-2X1BITSC70  [SC70]
U20  NC7WZ16  BUFFER-2X1BITSC70  [SC70]
Y1  ECS-.327-12.5-34QCS-TR  CRYSTAL-2LEAD32.768KHZ-ECX_34R  [CRYSTAL-3.2X1.5]

### Nets
3.3V: C23.1 C30.1 C33.2 C37.1 C38.1 J2.1 JP5.1 R68.1 R69.1 R76.1 R77.1 R78.1 R79.1 R80.1 R81.1 R83.1 R106.2 R107.1 R108.1 U9.12(CH4) U9.14(CH6) U9.17(CH9) U9.18(CH10) U9.21(CH13) U9.22(CH14) U10.23(CH15) U14.20(E1:VCC) U15.2(E1) U15.3(E2) U15.8(VCC) U16.13(BASE:VDDA/VREF+) U16.19(BASE:VDD) U16.32(BASE:VDD) U16.48(BASE:VDDUSB) U16.64(BASE:VDD) U17.5(A:VCC) U18.5(A:VCC) U19.5(A:VCC) ; also sheet 1
3.3V_ISENSE: U12.20(CH12) ; also sheet 1
5.0V_VIN: U12.22(CH14) ; also sheet 1
5V: C13.1 C15.1 C17.1 C22.1 C26.1 L1.2 R55.1 R58.1 R59.1 R62.1 R63.1 U7.1(VDD) U7.3(!SHDN) U8.28(VCC) U9.9(CH1) U9.11(CH3) U9.28(VCC) U10.9(CH1) U10.28(VCC) U11.5(A:VCC) U12.28(VCC) ; also sheet 1
ADCA_ADCINN: U12.26(ADCINN) U12.27(MUXOUTN)
ADCA_ADCINP: U12.24(MUXOUTP) U12.25(ADCINP)
ADCB_ADCINN: U9.26(ADCINN) U9.27(MUXOUTN)
ADCB_ADCINP: U9.24(MUXOUTP) U9.25(ADCINP)
ADCC_ADCINN: U8.26(ADCINN) U8.27(MUXOUTN)
ADCC_ADCINP: U8.24(MUXOUTP) U8.25(ADCINP)
ADCF_ADCINN: U10.26(ADCINN) U10.27(MUXOUTN)
ADCF_ADCINP: U10.24(MUXOUTP) U10.25(ADCINP)
AGND: C10.2 C13.2 C14.2 C18.C R56.1 U7.2(AGND) U7.4(AGND) U7.5(AGND) U7.6(AGND) U7.PAD(AGND) U8.7(COM) U8.8(CH0) U8.9(CH1) U8.10(CH2) U8.11(CH3) U8.30(REF-) U9.7(COM) U9.30(REF-) U10.7(COM) U10.30(REF-) U12.7(COM) U12.30(REF-) ; also sheet 1
AVREF: C10.1 C18.A L1.1 U10.29(REF+) ; also sheet 1
BUS_I2C0_IRQ: J1.177(DATABUS:BUS_I2C0_IRQ) J1.179(DATABUS:BUS_I2C0_IRQ) U16.57(B:PB5)
BUS_I2C0_SCL: J1.173(DATABUS:BUS_I2C0_SCL) J1.175(DATABUS:BUS_I2C0_SCL) R68.2 U16.58(B:PB6)
BUS_I2C0_SDA: J1.169(DATABUS:BUS_I2C0_SDA) J1.171(DATABUS:BUS_I2C0_SDA) R69.2 U16.59(B:PB7)
BUS_JTAG_TCK: J1.185(DATABUS:BUS_JTAG_TCK) J1.187(DATABUS:BUS_JTAG_TCK) U14.2(E1:A1)
BUS_JTAG_TDI: J1.189(DATABUS:BUS_JTAG_TDI) J1.191(DATABUS:BUS_JTAG_TDI) U14.4(E1:A2)
BUS_JTAG_TDO: J1.193(DATABUS:BUS_JTAG_TDO) J1.195(DATABUS:BUS_JTAG_TDO) U14.5(E2:Y3)
BUS_JTAG_TMS: J1.197(DATABUS:BUS_JTAG_TMS) J1.199(DATABUS:BUS_JTAG_TMS) U14.6(E1:A3)
CTRL_!RESET: C49.1 J1.174(DATABUS:CTRL_!RESET) J1.176(DATABUS:CTRL_!RESET) J2.5 R106.1 U16.7(BASE:!NRST)
CTRL_SYNC: J1.178(DATABUS:CTRL_SYNC) J1.180(DATABUS:CTRL_SYNC) U16.2(C:PC13)
DGND: C15.2 C17.2 C22.2 C23.2 C26.2 C30.2 C33.1 C37.2 C38.2 C49.2 C50.2 C51.2 J2.3 JP4.1 JP5.3 U8.1(DGND) U8.4(DGND) U8.6(DGND) U8.31(DGND) U8.32(DGND) U8.33(DGND) U8.34(DGND) U8.35(F0) U8.36(CA0) U8.37(CA1) U8.PAD(DGND) U9.1(DGND) U9.4(DGND) U9.6(DGND) U9.31(DGND) U9.32(DGND) U9.33(DGND) U9.34(DGND) U9.35(F0) U9.37(CA1) U9.38(CA2) U9.PAD(DGND) U10.1(DGND) U10.4(DGND) U10.6(DGND) U10.31(DGND) U10.32(DGND) U10.33(DGND) U10.34(DGND) U10.35(F0) U10.38(CA2) U10.PAD(DGND) U12.1(DGND) U12.4(DGND) U12.6(DGND) U12.31(DGND) U12.32(DGND) U12.33(DGND) U12.34(DGND) U12.35(F0) U12.36(CA0) U12.37(CA1) U12.38(CA2) U12.PAD(DGND) U14.3(E2:Y4) U14.7(E2:Y2) U14.8(E1:A4) U14.9(E2:Y1) U14.10(E1:GND) U14.11(E2:A1) U14.12(E1:Y4) U14.13(E2:A2) U14.17(E2:A4) U14.PAD(E1:GND) U15.4(GND) U16.12(BASE:VSSA/VREF-) U16.18(BASE:VSS) U16.31(BASE:VSS) U16.47(BASE:VSS) U16.63(BASE:VSS) ; also sheet 1
I2C_SCL: R63.2 U8.2(SCL) U9.2(SCL) U10.2(SCL) U12.2(SCL) U15.6(SCL) U16.29(B:PB10)
I2C_SDA: R62.2 U8.3(SDA) U9.3(SDA) U10.3(SDA) U12.3(SDA) U15.5(SDA) U16.30(B:PB11)
I3.3V_0: U9.15(CH7) ; also sheet 1
I3.3V_1: U9.23(CH15) ; also sheet 1
I3.3V_2: U9.20(CH12) ; also sheet 1
I3.3V_3: U9.19(CH11) ; also sheet 1
I3.3V_4: U9.16(CH8) ; also sheet 1
I3.3V_5: U9.13(CH5) ; also sheet 1
I5.0V_0: U9.10(CH2) ; also sheet 1
I5.0V_1: U9.8(CH0) ; also sheet 1
IBATT-: U12.15(CH7) ; also sheet 1
IHEATER: U12.19(CH11) ; also sheet 1
IUNREG_0: U8.17(CH9) ; also sheet 1
IUNREG_1: U8.18(CH10) ; also sheet 1
IUNREG_2: U8.21(CH13) ; also sheet 1
IUNREG_3: U8.22(CH14) ; also sheet 1
IUNREG_4: U8.12(CH4) ; also sheet 1
IUNREG_5: U8.14(CH6) ; also sheet 1
JTAG_SEL_PMIC: JP2.2 U14.1(E1:!EN) U14.19(E2:!EN)
JTAG_SEL_PMIC0: J1.165(GPIO:GPIO_165) JP2.1
JTAG_SEL_PMIC1: J1.167(GPIO:GPIO_167) JP2.3
JTAG_TCK: J2.2 U14.18(E1:Y1) U16.49(A:PA14)
JTAG_TDI: U14.16(E1:Y2) U16.50(A:PA15)
JTAG_TDO: J2.6 U14.15(E2:A3) U16.55(B:PB3)
JTAG_TMS: J2.4 U14.14(E1:Y3) U16.46(A:PA13)
MEM_!WC: U15.7(!WC) U16.16(A:PA2)
OSC32_IN: C50.1 U16.3(C:PC14) Y1.2
OSC32_OUT: C51.1 U16.4(C:PC15) Y1.1
PGND: D1.C D4.C D7.C D9.C D10.C D13.C D16.C D19.C D22.C D25.C D27.C D28.C D29.C D30.C D31.C D32.C D33.C D34.C D41.C D42.C D43.C D44.C D45.C D46.C D47.C D48.C D49.C D50.C U1.2(A:GND) U2.2(A:GND) U3.2(A:GND) U11.2(A:GND) U17.2(A:GND) U18.2(A:GND) U19.2(A:GND) U20.2(A:GND) ; also sheet 1
PMIC_BOOT0: JP4.2 U16.60(BASE:PH3-BOOT0)
PMIC_I2C_SCL: J1.183(DATABUS:PMIC_I2C_SCL) R107.2 U16.8(C:PC0)
PMIC_I2C_SDA: J1.181(DATABUS:PMIC_I2C_SDA) R108.2 U16.9(C:PC1)
PRIMARY_SELECT: JP5.2 U16.61(B:PB8)
PV_VOUT: U12.13(CH5) U12.14(CH6) U12.17(CH9) ; also sheet 1
PVA+: U10.10(CH2) U12.11(CH3) ; also sheet 1
PVA_IC_VOUT: U12.16(CH8) ; also sheet 1
PVA_IIN-: U12.10(CH2) ; also sheet 1
PVA_XSHUT: U16.15(A:PA1) ; also sheet 1
PVB+: U10.11(CH3) U12.8(CH0) ; also sheet 1
PVB_IC_VOUT: U12.12(CH4) ; also sheet 1
PVB_IIN-: U12.9(CH1) ; also sheet 1
PVB_XSHUT: U16.14(A:PA0) ; also sheet 1
STAT_3.3V_0: R76.2 U17.3(B:A) ; also sheet 1
STAT_3.3V_0_BUFF: R70.1 U17.4(B:Y)
STAT_3.3V_0_LED: D27.A R70.2
STAT_3.3V_1: R77.2 U17.1(A:A) ; also sheet 1
STAT_3.3V_1_BUFF: R71.1 U17.6(A:Y)
STAT_3.3V_1_LED: D28.A R71.2
STAT_3.3V_2: R78.2 U18.3(B:A) ; also sheet 1
STAT_3.3V_2_BUFF: R72.1 U18.4(B:Y)
STAT_3.3V_2_LED: D29.A R72.2
STAT_3.3V_3: R79.2 U18.1(A:A) ; also sheet 1
STAT_3.3V_3_BUFF: R73.1 U18.6(A:Y)
STAT_3.3V_3_LED: D30.A R73.2
STAT_3.3V_4: R80.2 U19.3(B:A) ; also sheet 1
STAT_3.3V_4_BUFF: R74.1 U19.4(B:Y)
STAT_3.3V_4_LED: D31.A R74.2
STAT_3.3V_5: R81.2 U19.1(A:A) ; also sheet 1
STAT_3.3V_5_BUFF: R75.1 U19.6(A:Y)
STAT_3.3V_5_LED: D32.A R75.2
STAT_3.3VON_LED: D25.A R83.2
STAT_5.0V_0: R58.2 U11.1(A:A) ; also sheet 1
STAT_5.0V_0_BUFF: R57.1 U11.6(A:Y)
STAT_5.0V_0_LED: D19.A R57.2
STAT_5.0V_1: R55.2 U11.3(B:A) ; also sheet 1
STAT_5.0V_1_BUFF: R54.1 U11.4(B:Y)
STAT_5.0V_1_LED: D16.A R54.2
STAT_5.0VON_LED: D22.A R59.2
STAT_PVA: U20.3(B:A) ; also sheet 1
STAT_PVA_BUFF: R88.1 U20.4(B:Y)
STAT_PVA_LED: D33.A R88.2
STAT_PVB: U20.1(A:A) ; also sheet 1
STAT_PVB_BUFF: R89.1 U20.6(A:Y)
STAT_PVB_LED: D34.A R89.2
STAT_PWR_0: R103.1 U16.26(B:PB0)
STAT_PWR_0_LED: D48.A R103.2
STAT_PWR_1: R102.1 U16.25(C:PC5)
STAT_PWR_1_LED: D47.A R102.2
STAT_PWR_2: R101.1 U16.24(C:PC4)
STAT_PWR_2_LED: D46.A R101.2
STAT_PWR_3: R100.1 U16.23(A:PA7)
STAT_PWR_3_LED: D45.A R100.2
STAT_PWR_4: R99.1 U16.22(A:PA6)
STAT_PWR_4_LED: D44.A R99.2
STAT_PWR_5: R98.1 U16.21(A:PA5)
STAT_PWR_5_LED: D43.A R98.2
STAT_PWR_6: R97.1 U16.20(A:PA4)
STAT_PWR_6_LED: D42.A R97.2
STAT_PWR_7: R96.1 U16.17(A:PA3)
STAT_PWR_7_LED: D41.A R96.2
STAT_PWR_-1: R104.1 U16.27(B:PB1)
STAT_PWR_-1_LED: D49.A R104.2
STAT_PWR_-2: R105.1 U16.28(B:PB2)
STAT_PWR_-2_LED: D50.A R105.2
STAT_UNREG_0: R6.2 U1.1(A:A) ; also sheet 1
STAT_UNREG_0_BUFF: R1.1 U1.6(A:Y)
STAT_UNREG_0_LED: D1.A R1.2
STAT_UNREG_1: R17.2 U1.3(B:A) ; also sheet 1
STAT_UNREG_1_BUFF: R5.1 U1.4(B:Y)
STAT_UNREG_1_LED: D4.A R5.2
STAT_UNREG_2: R18.2 U3.1(A:A) ; also sheet 1
STAT_UNREG_2_BUFF: R24.1 U3.6(A:Y)
STAT_UNREG_2_LED: D9.A R24.2
STAT_UNREG_3: R48.2 U3.3(B:A) ; also sheet 1
STAT_UNREG_3_BUFF: R41.1 U3.4(B:Y)
STAT_UNREG_3_LED: D13.A R41.2
STAT_UNREG_4: R29.2 U2.1(A:A) ; also sheet 1
STAT_UNREG_4_BUFF: R20.1 U2.6(A:Y)
STAT_UNREG_4_LED: D10.A R20.2
STAT_UNREG_5: R12.2 U2.3(B:A) ; also sheet 1
STAT_UNREG_5_BUFF: R14.1 U2.4(B:Y)
STAT_UNREG_5_LED: D7.A R14.2
SW_3.3V_0: U16.41(A:PA8) ; also sheet 1
SW_3.3V_1: U16.40(C:PC9) ; also sheet 1
SW_3.3V_2: U16.36(B:PB15) ; also sheet 1
SW_3.3V_3: U16.37(C:PC6) ; also sheet 1
SW_3.3V_4: U16.38(C:PC7) ; also sheet 1
SW_3.3V_5: U16.39(C:PC8) ; also sheet 1
SW_5.0V_0: U16.35(B:PB14) ; also sheet 1
SW_5.0V_1: U16.34(B:PB13) ; also sheet 1
SW_HEATER: U16.33(B:PB12) ; also sheet 1
SW_UNREG_0: U16.44(A:PA11) ; also sheet 1
SW_UNREG_1: U16.45(A:PA12) ; also sheet 1
SW_UNREG_2: U16.52(C:PC11) ; also sheet 1
SW_UNREG_3: U16.53(C:PC12) ; also sheet 1
SW_UNREG_4: U16.42(A:PA9) ; also sheet 1
SW_UNREG_5: U16.43(A:PA10) ; also sheet 1
TEMP_BATT: U10.16(CH8) ; also sheet 1
TEMP_MPPT-A: U10.14(CH6) ; also sheet 1
TEMP_MPPT-B: U10.15(CH7) ; also sheet 1
TEMP_PCB+X+Y: U10.18(CH10) ; also sheet 1
TEMP_PCB+X-Y: U10.13(CH5) ; also sheet 1
TEMP_PCB-X+Y: U10.20(CH12) ; also sheet 1
TEMP_PCB-X-Y: U10.22(CH14) ; also sheet 1
TEMP_PMIC: U10.21(CH13) ; also sheet 1
TEMP_REG-3.3V: U10.17(CH9) ; also sheet 1
TEMP_REG-5.0V: U10.19(CH11) ; also sheet 1
VBATT: R6.1 R12.1 R17.1 R18.1 R29.1 R48.1 U1.5(A:VCC) U2.5(A:VCC) U3.5(A:VCC) U8.13(CH5) U8.15(CH7) U8.16(CH8) U8.19(CH11) U8.20(CH12) U8.23(CH15) U10.12(CH4) U12.18(CH10) U12.21(CH13) U12.23(CH15) U20.5(A:VCC) ; also sheet 1
VREF_CURRENT: R50.2 R56.2 U8.29(REF+) U9.29(REF+) U10.8(CH0) U12.29(REF+)
VREF_CURRENT_OUT: C14.1 R50.1 U7.7(OUT) U7.8(FB)
Unconnected: J1.141(DATABUS:BUS_SPI_MOSI) J1.142(RCS:COM_USART_TX) J1.143(DATABUS:BUS_SPI_MOSI) J1.144(RCS:COM_USART_TX) J1.145(DATABUS:BUS_SPI_MISO) J1.146(RCS:COM_USART_RX) J1.147(DATABUS:BUS_SPI_MISO) J1.148(RCS:COM_USART_RX) J1.149(DATABUS:BUS_SPI_SCK) J1.150(RCS:COM_USART_CLK) J1.151(DATABUS:BUS_SPI_SCK) J1.152(RCS:COM_USART_CLK) J1.153(GPIO:GPIO_153) J1.154(RCS:COM_IRQ) J1.155(GPIO:GPIO_155) J1.156(RCS:COM_IRQ) J1.157(GPIO:GPIO_157) J1.158(GPIO:GPIO_158) J1.159(GPIO:GPIO_159) J1.160(DATABUS:BUS_I2C1_SDA) J1.161(GPIO:GPIO_161) J1.162(DATABUS:BUS_I2C1_SCL) J1.163(GPIO:GPIO_163) J1.164(DATABUS:BUS_I2C1_IRQ) U8.38(CA2) U9.36(CA0) U10.36(CA0) U10.37(CA1) U16.5(BASE:PH0-OSC_IN) U16.6(BASE:PH1-OSC_OUT) U16.10(C:PC2) U16.11(C:PC3) U16.51(C:PC10) U16.54(BASE:PD2) U16.56(B:PB4) U16.62(B:PB9)

### Notes on the sheet
- ADC-A | ADC-B | ADC-C | ADC-D | Voltage Reference - Current
- Differential Mode: ±0.104V | Differential Mode: ±0.104V | Differential Mode: ±0.104V | Single Ended Mode: 0-5.3V
- Addr: B0010100x = 0x28 | R/W | Addr: B0010101x = 0x2A | R/W | Addr: B0110101x = 0x6A | R/W | Addr: B0100100 = 0x48 | R/W
- 1.0240V
- 0.208V
- Voltage Reference - Voltage
- Indication | Power Meter
- PMIC | SWD Programming | I2C Pullups | JTAG Enable Connectivity | Coug Sat Bus - Data lines
- EEPROM
- Memory Addr: B101011xx = 0xAC | byteAddr[16] | R/W
  Device Addr: B101111xx = 0xBC | R/W
- Close to VDD pins
- Battery Mounting
- PMIC - GPIO Bank A | PMIC - GPIO Bank B | PMIC - GPIO Bank C
- GPIO subject to change | GPIO subject to change | GPIO subject to change
- Power Board Information & Ratings
- ~Each power bus line is rated for 1A
  ~Total power bus lines is rated for 4A
  ~Each unregulated power line is rated for 1A
  ~RTC source is internal 32kHz oscillator of PMIC
  ~On board I2C is 5V logic level
  ~Bus I2C is pulled high on this board to 3.3V
  ~Bus Reset is pulled high on this board to 3.3V
  ~Load switching is controlled through ideal diode  
       Asserting high turns off load. Internally pulled low, load on.
  ~Voltage ADC measures current voltage reference to get absolute reference
  ~PMIC sends out global sync pulse

## Sheet 3 of 3
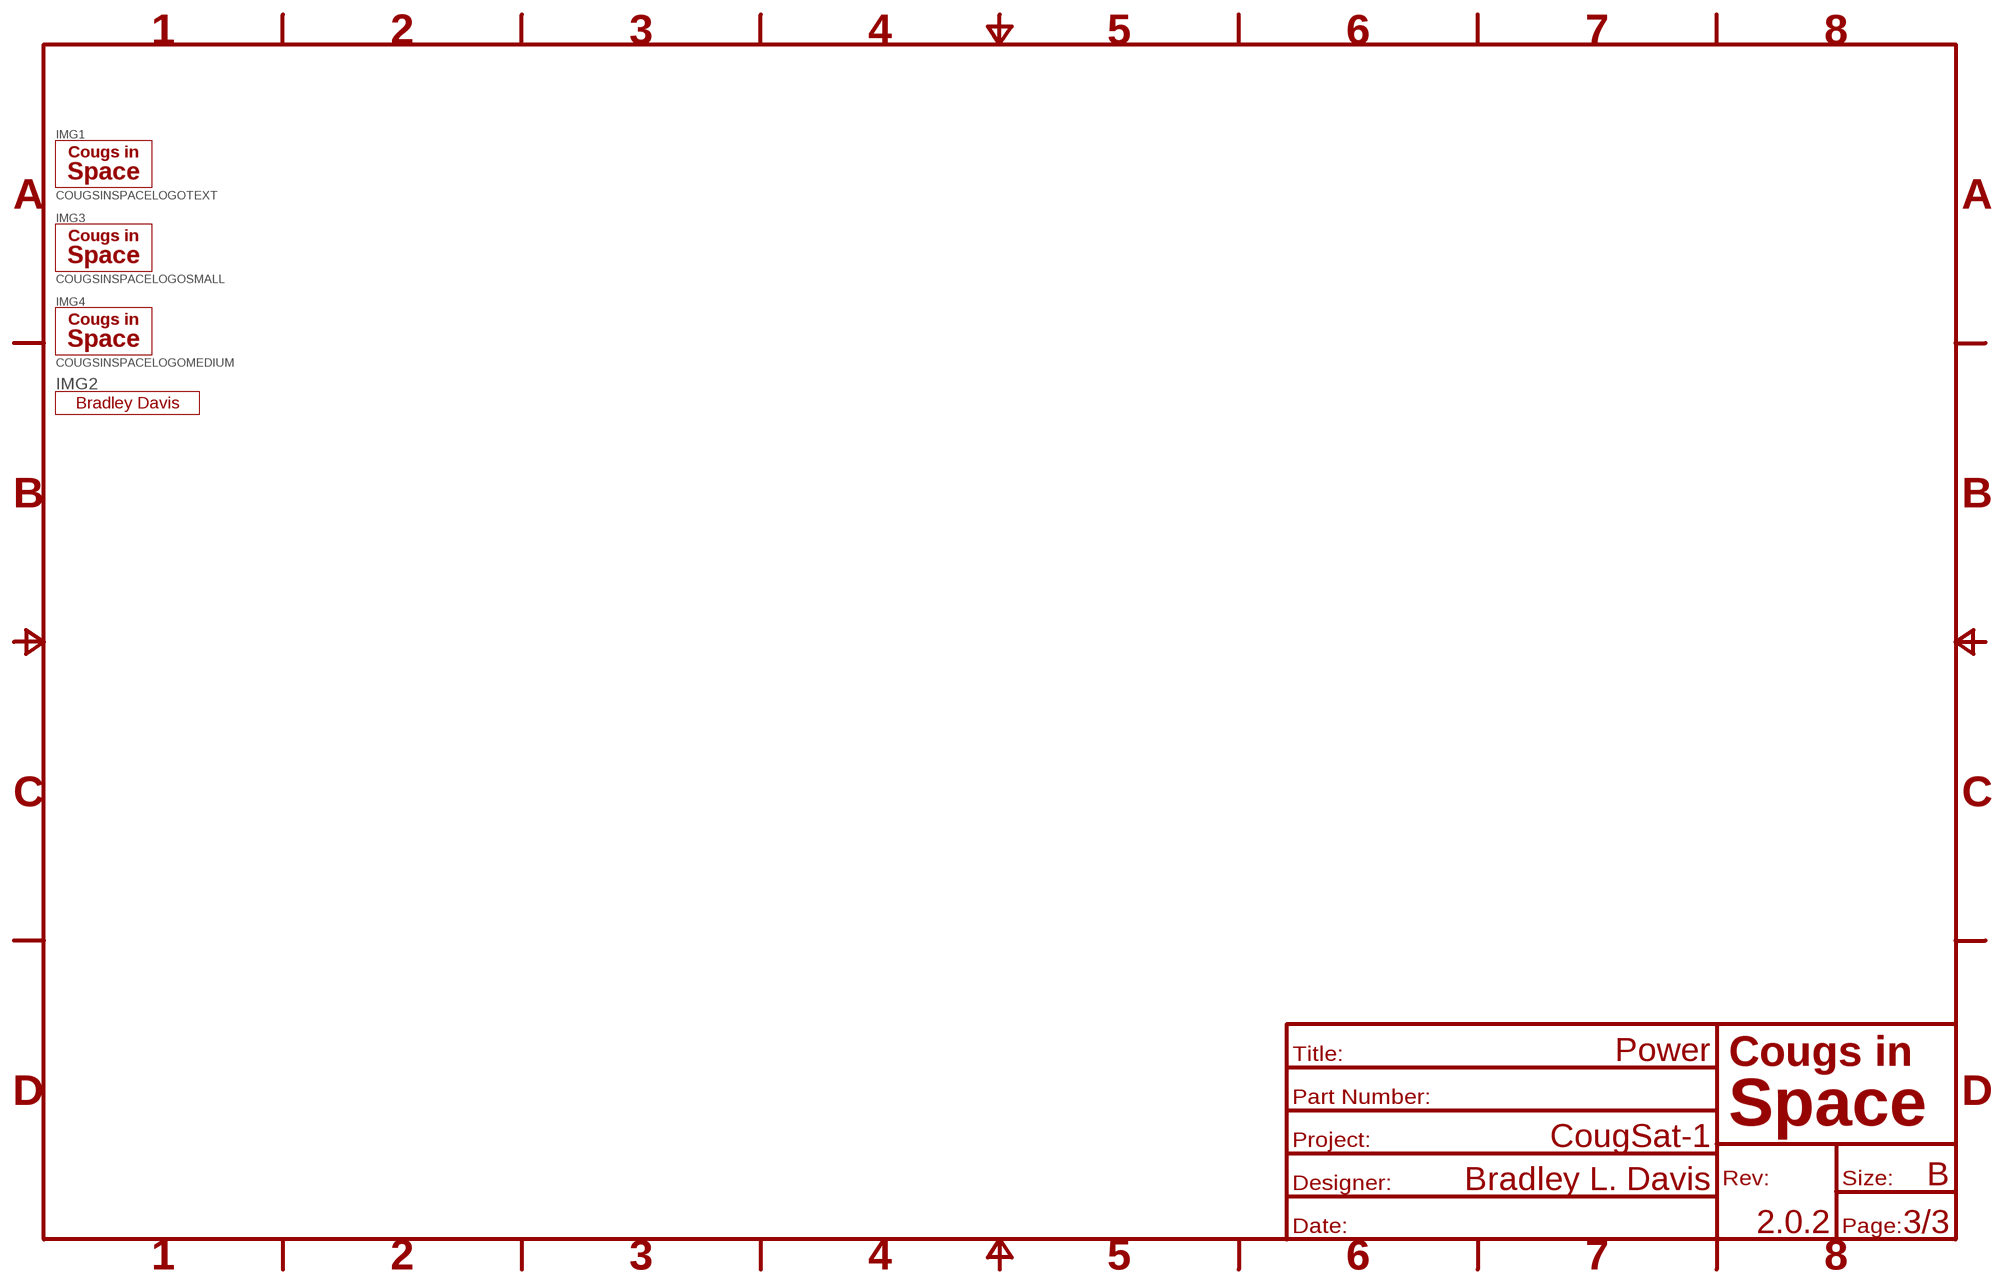
[diagram p3: schematic, sheet 3]

### Parts
IMG1  COUGSINSPACELOGOTEXT  [COUGSINSPACETEXT]
IMG2  Bradley Davis  SIGNATURE  [SIGNATURE-BRADLEY]
IMG3  COUGSINSPACELOGOSMALL  [COUGSINSPACELOGO_SMALL]
IMG4  COUGSINSPACELOGOMEDIUM  [COUGSINSPACELOGO_MEDIUM]

## Power pins joined to a net without a drawn wire
VBAT: U16.1(BASE:VBAT)

## Library data of the parts
BT1 BT2 = CougsInSpace:BATTERY
C1-C11 C13-C15 C17 C19-C26 C28 C30-C38 C43-C52 = CougsInSpace:CAPACITOR
C12 C16 C18 C27 C29 C39-C42 = CougsInSpace:CAPACITOR-POLARIZED
D1 D4 D5 D7 D9 D10 D13 D16 D19 D22 D25 D27-D34 D41-D50 = CougsInSpace:LED
D2 D3 D6 D8 D11 D12 D17 D20 D23 D24 D35-D40 = CougsInSpace:DIODE-IDEAL
D14 D15 D18 D21 D26 = CougsInSpace:DIODE-SCHOTTKY
H1-H6 = CougsInSpace:MOUNTING_HOLE_PLAIN
IMG1 IMG3 IMG4 = CougsInSpace:COUGSINSPACELOGO
IMG2 = CougsInSpace:SIGNATURE
J1 = CougsInSpace:COUGSATBUS
J2 = CougsInSpace:CONN_06
J3-J6 = CougsInSpace:CONN_04
JP1 JP3 = CougsInSpace:SHORTCIRCUIT
JP2 JP5 = CougsInSpace:JUMPER-SMT_3_NO: Normally open jumper This jumper has three pads in close proximity to each other. Apply solder to close the connection(s).
JP4 = CougsInSpace:JUMPER-SMT_2_NC_PASTE: Normally closed solder jumper This jumper has an aperture in the stencil to allow solder paste to bridge the split in the wire so it's normally closed (NC). Wick off the solder to open the connection. Reapply solder to reclose the connection.
L1-L5 = CougsInSpace:INDUCTOR
Q1-Q3 Q6 = CougsInSpace:MOSEFT-PCHANNEL
Q4 Q5 = CougsInSpace:MOSFET-NCHANNEL
R1-R111 = CougsInSpace:RESISTOR
RT1-RT10 = CougsInSpace:THERMISTOR
U1-U3 U11 U17-U20 = CougsInSpace:BUFFER-2X1BIT
U4 = CougsInSpace:BQ2970
U5 U6 = CougsInSpace:SPV1040
U7 = CougsInSpace:VOLTAGEREFERENCE
U8-U10 U12 = CougsInSpace:LTC2499
U13 = CougsInSpace:TPS61236P
U14 = CougsInSpace:BUFFER_TRISTATE-2X4BIT
U15 = CougsInSpace:EEPROM
U16 = CougsInSpace:STM32L476R
U21 = CougsInSpace:TPS64200
Y1 = CougsInSpace:CRYSTAL-2LEAD